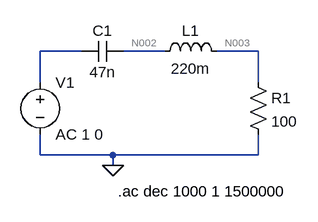
[diagram p0: schematic Draft1.asc]
Draft1.asc, the LTspice schematic file:
Version 4
SHEET 1 880 680
WIRE 160 80 96 80
WIRE 288 80 224 80
WIRE 432 80 368 80
WIRE 96 128 96 80
WIRE 432 128 432 80
WIRE 96 240 96 208
WIRE 208 240 96 240
WIRE 432 240 432 208
WIRE 432 240 208 240
WIRE 208 256 208 240
FLAG 208 256 0
SYMBOL voltage 96 112 R0
SYMATTR InstName V1
SYMATTR Value AC 1 0
SYMBOL cap 224 64 R90
WINDOW 0 0 32 VBottom 2
WINDOW 3 32 32 VTop 2
SYMATTR InstName C1
SYMATTR Value 47n
SYMBOL ind 272 96 R270
WINDOW 0 32 56 VTop 2
WINDOW 3 5 56 VBottom 2
SYMATTR InstName L1
SYMATTR Value 220m
SYMBOL res 416 112 R0
SYMATTR InstName R1
SYMATTR Value 100
TEXT 216 296 Left 2 !.ac dec 1000 1 1500000

The netlist it stands for:
* Draft1.asc
V1 N001 0 AC 1 0
C1 N002 N001 47n
L1 N002 N003 220m
R1 N003 0 100
.ac dec 1000 1 1500000
.backanno
.end

* Results of the author's LTspice run, read from the files saved beside the schematic
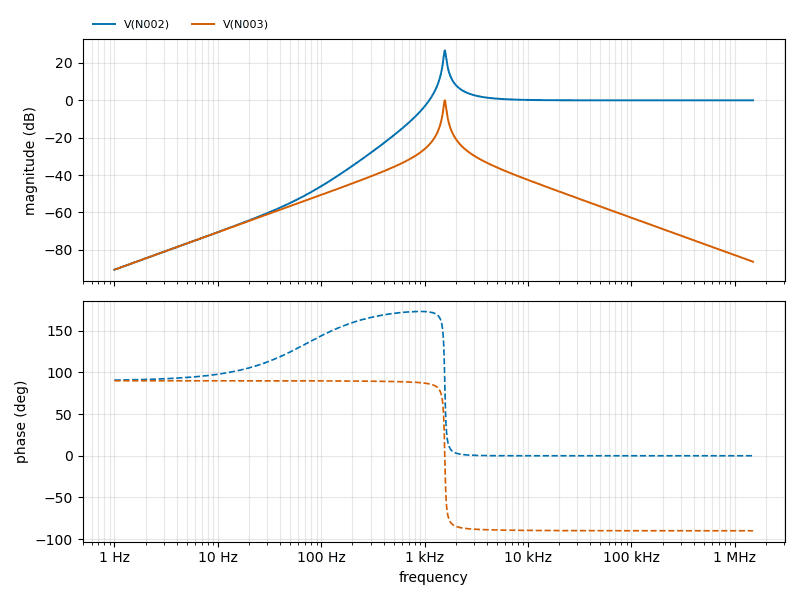
[diagram p1: AC Analysis of Draft1.asc, plotted from the saved traces]
* AC Analysis, 1 run:
*   V(N002): -90.59 dB at 1 Hz, 0.00 dB at 1.5 MHz, peak 26.71 dB at 1.567 kHz, 3 dB below the peak at 1.531 kHz and 1.604 kHz
*   V(N003): -90.59 dB at 1 Hz, -86.33 dB at 1.5 MHz, peak -0.01 dB at 1.567 kHz, 3 dB below the peak at 1.529 kHz and 1.602 kHz